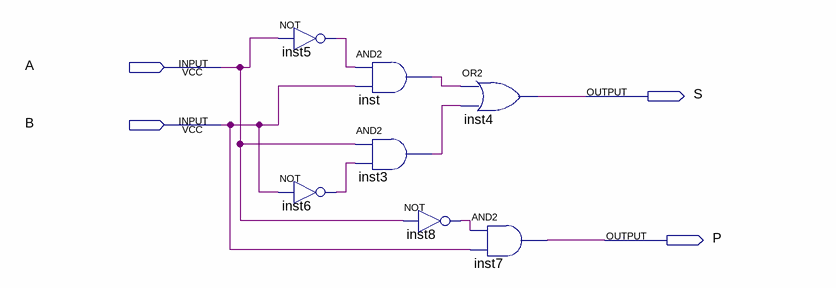
[diagram p0: schematic sheet]
// Quartus schematic Block1.bdf as structural Verilog: 7 symbols, 4 pins
module Block1 (
  input  A,
  input  B,
  output S,
  output P
);

  wire inst3_out, inst5_out, inst6_out, inst8_out, inst_out;

  not inst5 (inst5_out, A);
  not inst6 (inst6_out, B);
  and inst (inst_out, inst5_out, B);
  and inst3 (inst3_out, A, inst6_out);
  not inst8 (inst8_out, A);
  or inst4 (S, inst_out, inst3_out);
  and inst7 (P, inst8_out, B);
endmodule
